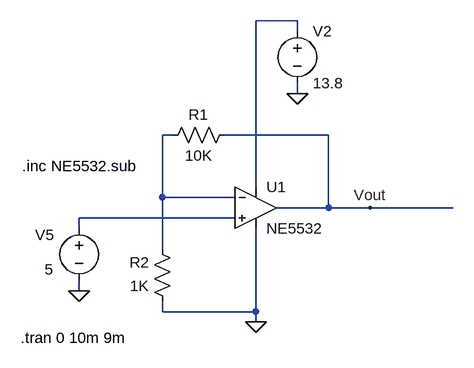
[diagram p0: schematic NE5532 Voltage Amplifier.asc]
NE5532 Voltage Amplifier.asc, the LTspice schematic file:
Version 4
SHEET 1 2540 788
WIRE 528 -80 464 -80
WIRE 528 -64 528 -80
WIRE 528 32 528 16
WIRE 336 96 320 96
WIRE 576 96 416 96
WIRE 464 176 464 -80
WIRE 320 192 320 96
WIRE 432 192 320 192
WIRE 576 208 576 96
WIRE 576 208 496 208
WIRE 640 208 576 208
WIRE 768 208 640 208
WIRE 432 224 192 224
WIRE 192 240 192 224
WIRE 320 272 320 192
WIRE 192 336 192 320
WIRE 320 368 320 352
WIRE 464 368 464 240
WIRE 464 368 320 368
WIRE 464 384 464 368
FLAG 464 384 0
FLAG 528 32 0
FLAG 640 208 Vout
FLAG 192 336 0
SYMBOL voltage 528 -80 R0
WINDOW 123 0 0 Left 2
WINDOW 39 0 0 Left 2
SYMATTR InstName V2
SYMATTR Value 13.8
SYMBOL Opamps\\opamp2 464 144 R0
SYMATTR InstName U1
SYMATTR Value NE5532
SYMBOL voltage 192 224 R0
WINDOW 123 0 0 Left 2
WINDOW 39 0 0 Left 2
WINDOW 0 -68 26 Left 2
WINDOW 3 -53 79 Left 2
SYMATTR InstName V5
SYMATTR Value 5
SYMBOL res 432 80 R90
WINDOW 0 0 56 VBottom 2
WINDOW 3 32 56 VTop 2
SYMATTR InstName R1
SYMATTR Value 10K
SYMBOL res 336 368 R180
WINDOW 0 36 76 Left 2
WINDOW 3 36 40 Left 2
SYMATTR InstName R2
SYMATTR Value 1K
TEXT 104 144 Left 2 !.inc NE5532.sub
TEXT 102 408 Left 2 !.tran 0 10m 9m

The netlist it stands for:
* NE5532 Voltage Amplifier.asc
V2 N001 0 13.8
XU1 N003 N002 N001 0 Vout NE5532  ; pins In+ In- V+ V- OUT
V5 N003 0 5
R1 Vout N002 10K
R2 0 N002 1K
.inc NE5532.sub
.tran 0 10m 9m
.backanno
.end